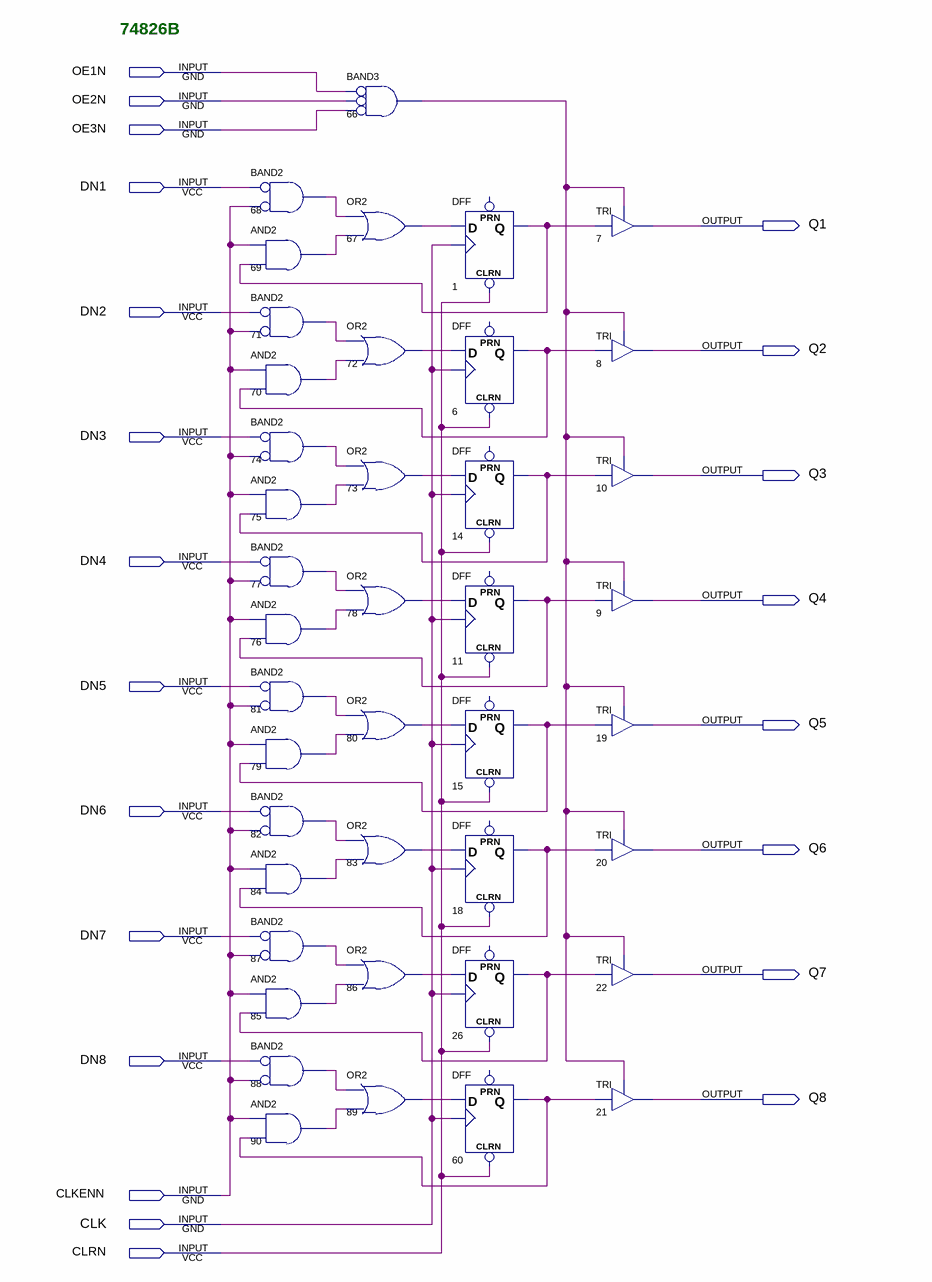
[diagram p0: schematic sheet]
// Quartus schematic 74826b.bdf as structural Verilog: 41 symbols, 22 pins
module \74826b  (
  input  OE1N,
  input  OE2N,
  input  OE3N,
  input  DN1,
  input  DN2,
  input  DN3,
  input  DN4,
  input  DN5,
  input  DN6,
  input  DN7,
  input  DN8,
  input  CLKENN,
  input  CLK,
  input  CLRN,
  output Q1,
  output Q2,
  output Q3,
  output Q4,
  output Q5,
  output Q6,
  output Q7,
  output Q8
);

  wire n1_q, n6_q, n11_q, n14_q, n15_q, n18_q, n26_q, n60_q, n66_out, n67_out, n68_out, n69_out, n70_out,
       n71_out, n72_out, n73_out, n74_out, n75_out, n76_out, n77_out, n78_out, n79_out, n80_out, n81_out,
       n82_out, n83_out, n84_out, n85_out, n86_out, n87_out, n88_out, n89_out, n90_out;

  and u_68 (n68_out, ~DN1, ~CLKENN);  // BAND2
  and u_69 (n69_out, CLKENN, n1_q);
  and u_71 (n71_out, ~DN2, ~CLKENN);  // BAND2
  and u_70 (n70_out, CLKENN, n6_q);
  and u_74 (n74_out, ~DN3, ~CLKENN);  // BAND2
  and u_75 (n75_out, CLKENN, n14_q);
  and u_77 (n77_out, ~DN4, ~CLKENN);  // BAND2
  and u_76 (n76_out, CLKENN, n11_q);
  and u_81 (n81_out, ~DN5, ~CLKENN);  // BAND2
  and u_79 (n79_out, CLKENN, n15_q);
  and u_82 (n82_out, ~DN6, ~CLKENN);  // BAND2
  and u_84 (n84_out, CLKENN, n18_q);
  and u_87 (n87_out, ~DN7, ~CLKENN);  // BAND2
  and u_85 (n85_out, CLKENN, n26_q);
  and u_88 (n88_out, ~DN8, ~CLKENN);  // BAND2
  and u_90 (n90_out, CLKENN, n60_q);
  and u_66 (n66_out, ~OE1N, ~OE2N, ~OE3N);  // BAND3
  or u_67 (n67_out, n68_out, n69_out);
  or u_72 (n72_out, n71_out, n70_out);
  or u_73 (n73_out, n74_out, n75_out);
  or u_78 (n78_out, n77_out, n76_out);
  or u_80 (n80_out, n81_out, n79_out);
  or u_83 (n83_out, n82_out, n84_out);
  or u_86 (n86_out, n87_out, n85_out);
  or u_89 (n89_out, n88_out, n90_out);
  DFF u_1 (.CLRN(CLRN), .CLK(CLK), .D(n67_out), .Q(n1_q));  // open: PRN
  DFF u_6 (.CLRN(CLRN), .CLK(CLK), .D(n72_out), .Q(n6_q));  // open: PRN
  DFF u_14 (.CLRN(CLRN), .CLK(CLK), .D(n73_out), .Q(n14_q));  // open: PRN
  DFF u_11 (.CLRN(CLRN), .CLK(CLK), .D(n78_out), .Q(n11_q));  // open: PRN
  DFF u_15 (.CLRN(CLRN), .CLK(CLK), .D(n80_out), .Q(n15_q));  // open: PRN
  DFF u_18 (.CLRN(CLRN), .CLK(CLK), .D(n83_out), .Q(n18_q));  // open: PRN
  DFF u_26 (.CLRN(CLRN), .CLK(CLK), .D(n86_out), .Q(n26_q));  // open: PRN
  DFF u_60 (.CLRN(CLRN), .CLK(CLK), .D(n89_out), .Q(n60_q));  // open: PRN
  TRI u_7 (.IN(n1_q), .OE(n66_out), .OUT(Q1));
  TRI u_8 (.IN(n6_q), .OE(n66_out), .OUT(Q2));
  TRI u_10 (.IN(n14_q), .OE(n66_out), .OUT(Q3));
  TRI u_9 (.IN(n11_q), .OE(n66_out), .OUT(Q4));
  TRI u_19 (.IN(n15_q), .OE(n66_out), .OUT(Q5));
  TRI u_20 (.IN(n18_q), .OE(n66_out), .OUT(Q6));
  TRI u_22 (.IN(n26_q), .OE(n66_out), .OUT(Q7));
  TRI u_21 (.IN(n60_q), .OE(n66_out), .OUT(Q8));

  // Notes on the sheet:
  //   74826B
endmodule
